# EAGLE design PSPi (EAGLE 7.6.0)
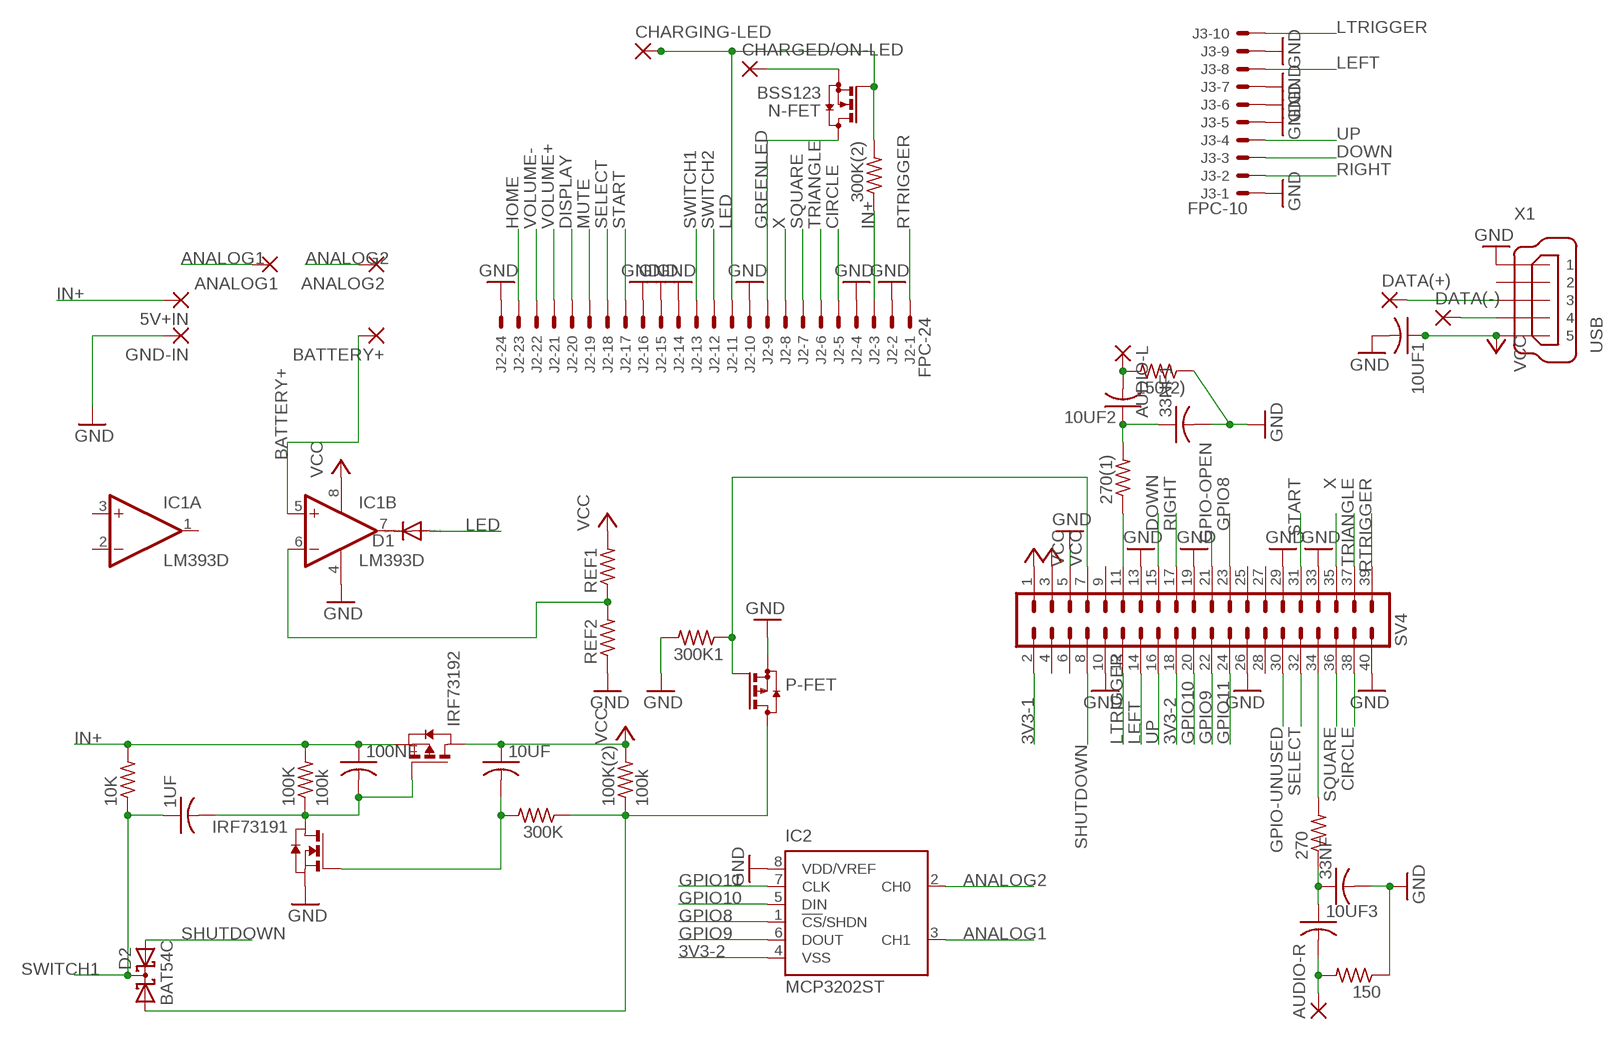
[diagram p0: schematic, sheet 1]

## Parts
1UF  C-USC0805  [C0805]
5V+IN  SMD2  [SMD1,27-2,54]
10K  R-US_R0805  [R0805]
10UF  C-USC0805  [C0805]
10UF1  C-USC0805  [C0805]
10UF2  C-USC0805  [C0805]
10UF3  C-USC0805  [C0805]
33NF  C-USC0805  [C0805]
33NF1  C-USC0805  [C0805]
100K  100k  R-US_R0805  [R0805]
100K(2)  100k  R-US_R0805  [R0805]
100NF  C-USC0805  [C0805]
150  R-US_R0805  [R0805]
150(2)  R-US_R0805  [R0805]
270  R-US_R0805  [R0805]
270(1)  R-US_R0805  [R0805]
300K  R-US_R0805  [R0805]
300K1  R-US_R0805  [R0805]
300K(2)  R-US_R0805  [R0805]
ANALOG1  SMD2  [SMD1,27-2,54]
ANALOG2  SMD2  [SMD1,27-2,54]
AUDIO-L  SMD2  [SMD1,27-2,54]
AUDIO-R  SMD2  [SMD1,27-2,54]
BATTERY+  SMD2  [SMD1,27-2,54]
CHARGED/ON-LED  SMD2  [SMD1,27-2,54]
CHARGING-LED  SMD2  [SMD1,27-2,54]
D1  DIODE-SOD323-R  [SOD323-R]
D2  BAT54C  [SOT23]
DATA(+)  SMD2  [SMD1,27-2,54]
DATA(-)  SMD2  [SMD1,27-2,54]
GND-IN  SMD2  [SMD1,27-2,54]
IC1  LM393D  [SO08]
IC2  MCP3202ST  [TSSOP8]
IRF7319  PN_MOSFET-SO8  [SO8]
J2  FPC-24  XF2R-2415-4A  [XF2R-2415-4A]
J3  FPC-10  XF2L-1035-1  [XF2L-1035-1]
N-FET  BSS123  [SOT23]
P-FET  BSS84  [SOT23]
REF1  R-US_R0805  [R0805]
REF2  R-US_R0805  [R0805]
SV4  MA20-2  [MA20-2]
X1  USB  MINI-USB-32005-201  [32005-201]

## Nets
3V3-1: SV4.2
3V3-2: IC2.4(VSS) SV4.18
ANALOG1: ANALOG1.1(P) IC2.3(CH1)
ANALOG2: ANALOG2.1(P) IC2.2(CH0)
BATTERY+: BATTERY+.1(P) IC1.5(B:+IN)
CIRCLE: J2.5 SV4.38
DISPLAY: J2.20
DOWN: J3.3 SV4.15
GND: 10UF1.2 33NF1.2 33NF.2 150(2).1 150.1 300K1.2 GND-IN.1(P) IC1.4(P:V-) IC2.8(VDD/VREF) IRF7319.1(1:S) J2.2 J2.4 J2.10 J2.14 J2.15 J2.16 J2.24 J3.1 J3.5 J3.6 J3.7 J3.9 P-FET.2(S) REF2.1 SV4.5 SV4.10 SV4.13 SV4.19 SV4.26 SV4.29 SV4.33 SV4.40 X1.1
GPIO8: IC2.1(!CS!/SHDN) SV4.23
GPIO9: IC2.6(DOUT) SV4.22
GPIO10: IC2.5(DIN) SV4.20
GPIO11: IC2.7(CLK) SV4.24
GPIO-OPEN: SV4.21
GPIO-UNUSED: SV4.30
GREENLED: J2.9 N-FET.3(D)
HOME: J2.23
IN+: 5V+IN.1(P) 10K.2 100K.2 100NF.1 300K(2).1 IRF7319.3(2:S) J2.3
LED: 300K(2).2 CHARGING-LED.1(P) D1.A J2.11 N-FET.1(G)
LEFT: J3.8 SV4.14
LTRIGGER: J3.10 SV4.12
MUTE: J2.19
N$1: IC1.6(B:-IN) REF1.1 REF2.2
N$2: D1.C IC1.7(B:OUT)
N$3: 1UF.2 100K.1 100NF.2 IRF7319.4(2:G) IRF7319.7(1:D) IRF7319.8(1:D)
N$4: DATA(-).1(P) X1.4
N$5: 10UF.2 300K.2 IRF7319.2(1:G)
N$6: 100K(2).1 300K.1 D2.1(A1) P-FET.3(D)
N$7: 300K1.1 P-FET.1(G) SV4.7
N$8: 10UF3.1 33NF.1 270.1
N$9: CHARGED/ON-LED.1(P) N-FET.2(S)
N$10: DATA(+).1(P) X1.3
N$11: 10UF2.1 33NF1.1 270(1).2
N$12: 10UF3.2 150.2 AUDIO-R.1(P)
N$13: 270.2 SV4.34
N$14: 270(1).1 SV4.11
N$16: 10UF2.2 150(2).2 AUDIO-L.1(P)
RIGHT: J3.2 SV4.17
RTRIGGER: J2.1 SV4.39
SELECT: J2.18 SV4.32
SHUTDOWN: D2.2(A2) SV4.8
SQUARE: J2.7 SV4.36
START: J2.17 SV4.31
SWITCH1: 1UF.1 10K.1 D2.3(CC) J2.13
SWITCH2: J2.12
TRIANGLE: J2.6 SV4.37
UP: J3.4 SV4.16
VCC: 10UF1.1 10UF.1 100K(2).2 IC1.8(P:V+) IRF7319.5(2:D) IRF7319.6(2:D) REF1.2 SV4.1 SV4.3 X1.5
VOLUME+: J2.21
VOLUME-: J2.22
X: J2.8 SV4.35
Unconnected: IC1.1(A:OUT) IC1.2(A:-IN) IC1.3(A:+IN) SV4.4 SV4.6 SV4.9 SV4.25 SV4.27 SV4.28 X1.2

## Library data of the parts
1UF 10UF 10UF1-10UF3 33NF 33NF1 100NF = resistor:C-US: CAPACITOR, American symbol
5V+IN ANALOG1 ANALOG2 AUDIO-L AUDIO-R BATTERY+ CHARGED/ON-LED CHARGING-LED DATA(+) DATA(-) GND-IN = wirepad:SMD2: SMD PAD
10K 100K 100K(2) 150 150(2) 270 270(1) 300K 300K1 300K(2) REF1 REF2 = resistor:R-US_: RESISTOR, American symbol
D1 = diode:DIODE-: DIODE
D2 = diode:BAT54C: Schottky Diodes Source: Fairchild .. BAT54.pdf
IC1 = linear:LM393: COMPARATOR
IC2 = microchip:MCP3202: 2.7V Dual Channel 12-Bit A/D Converter with SPI Serial Interface Source: http://ww1.microchip.com/downloads/en/DeviceDoc/21034D.pdf; MF: MICROCHIP; MPN: MCP3202-CI/ST; OC_FARNELL: unknown; OC_NEWARK: 59K0226
IRF7319 = zetex:PN_MOSFET-: DUAL N AND P-CHANNEL ENHANCEMENT MODE MOSFET Source: Data sheet <http://www.farnell.com/datasheets/1693880.pdf>; OC_FARNELL: unknown; OC_NEWARK: unknown
J2 = con-omron:XF2*-24?: OMRON FPC Connector Source : http://www.omron.com/ecb/products/pdf/fpc.pdf; MPN: XF2R-2415-4A; OC_FARNELL: unknown; OC_NEWARK: 37M0946
J3 = con-omron:XF2*-10?: OMRON FPC Connector Source : http://www.omron.com/ecb/products/pdf/fpc.pdf; MPN: XF2L-1035-1A; OC_FARNELL: 1430928; OC_NEWARK: 59M3516
N-FET = transistor-small-signal:BSS123: N-CHANNEL MOS FET
P-FET = transistor-small-signal:BSS84: P-CHANNEL MOS FET
SV4 = con-lstb:MA20-2: PIN HEADER; OC_FARNELL: unknown; OC_NEWARK: unknown
X1 = con-cypressindustries:MINI-USB-: MINI USB-B Conector Source: www.cypressindustries.com; OC_FARNELL: unknown; OC_NEWARK: unknown

## Board
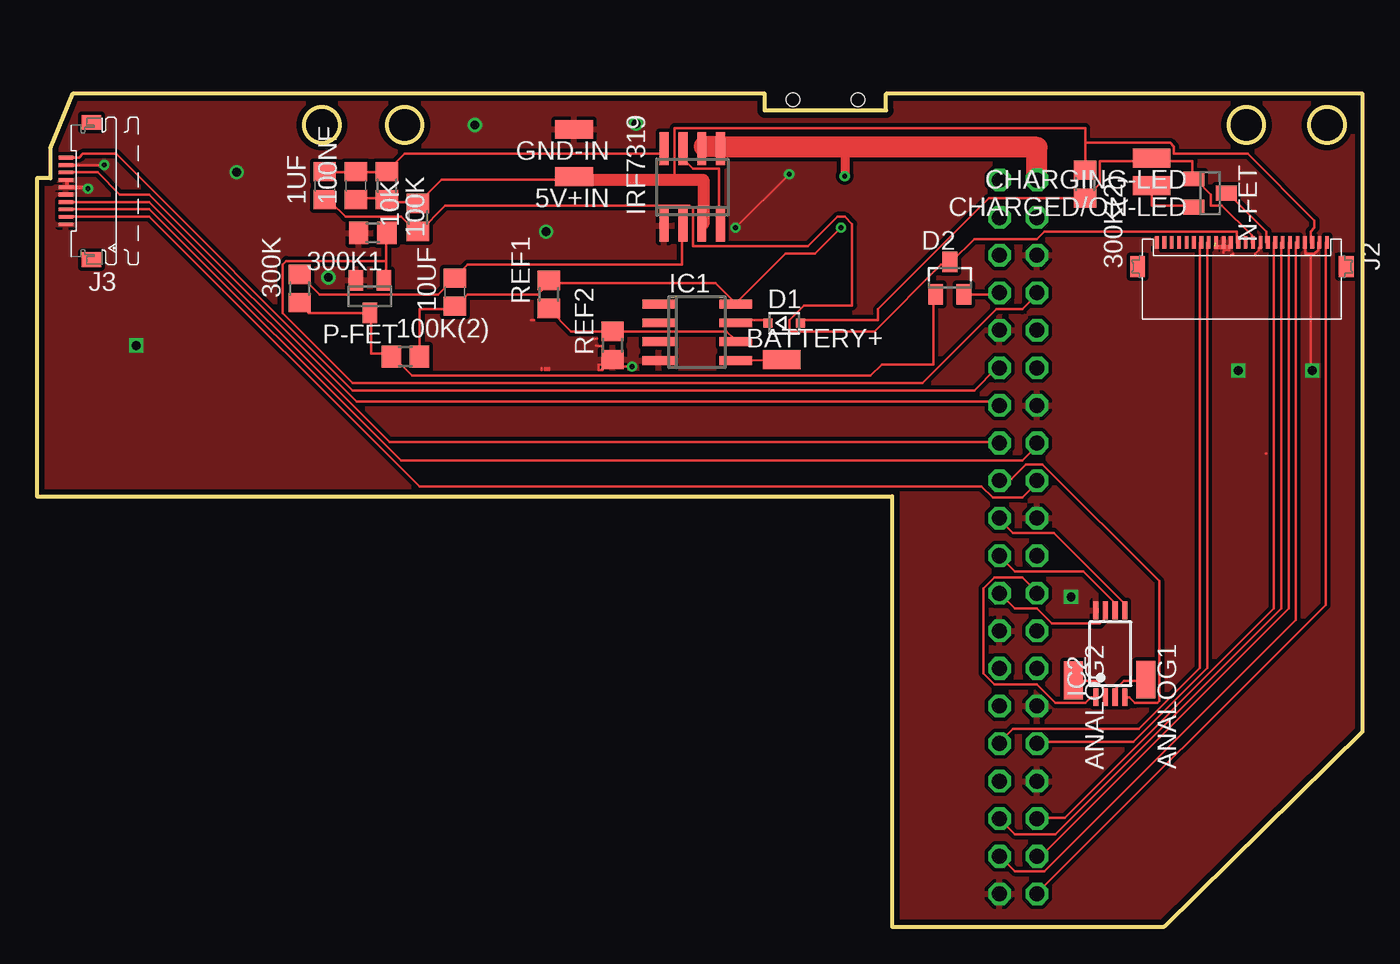
[diagram p1: board, top side]
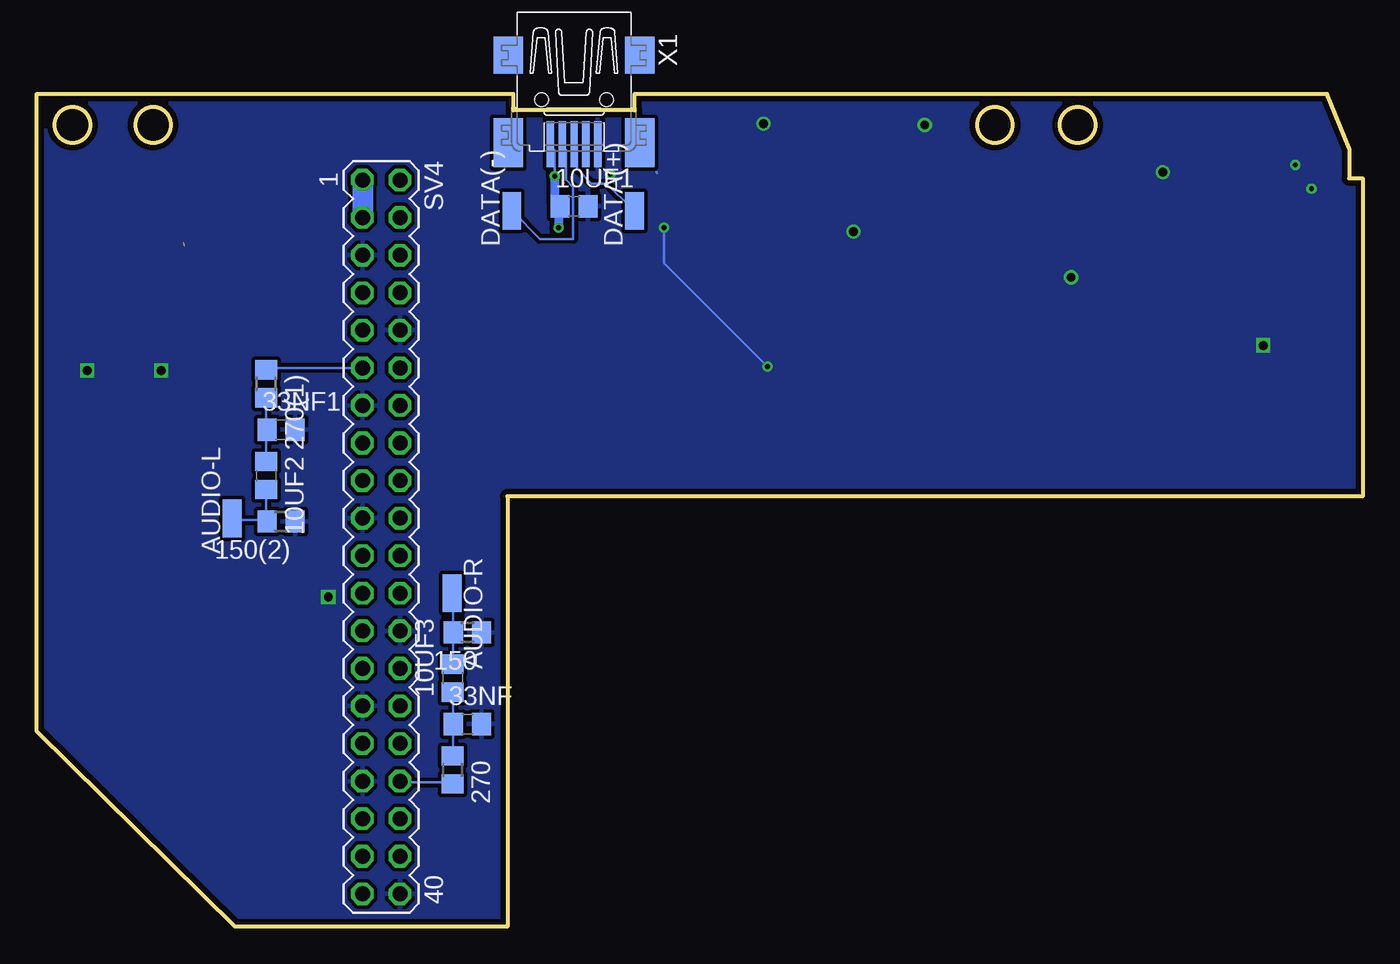
[diagram p2: board, bottom side, seen from below]

Size 89.6 x 56.3 mm. Coordinates in mm from the lower left corner, seen from the top.
Outline: 89.6,56.3 57.4,56.3 57.4,55.2 49.2,55.2 49.2,56.3 2.4,56.3 0.9,52.6 0.9,50.6 0,50.6 0,29.1 57.8,29.1 57.8,0 76.2,0 89.6,13.2 89.6,56.3
Outline: circle at 81.75,54.2 radius 1.2
Outline: circle at 87.2,54.2 radius 1.2
Outline: circle at 19.25,54.2 radius 1.2
Outline: circle at 24.85,54.2 radius 1.2
Copper layers (1*16): Top 0.0356mm / dielectric 1.5011mm / Bottom 0.0356mm
Design rules "OSHPark": minimum track width 6mil, minimum drill 13mil, track to track 6mil, track to pad 6mil, pad to pad 6mil, via to via 6mil, smd to smd 6mil, copper to edge 15mil, drill to drill 6mil, minimum pad ring 7mil, minimum via ring 7mil, stop-mask expansion 4mil, vias tented up to drill 0mil, thermal gap 10mil

### Footprints (pad centres in the part's own frame; a part is rotated, then mirrored left to right if it is on the bottom)
C0805 = smd 1.3 x 1.5: 1 -0.95,0; 2 0.95,0
SMD1,27-2,54 = smd 1.27 x 2.54: 1 0,0
R0805 = smd 1.3 x 1.5: 1 -0.95,0; 2 0.95,0
SOD323-R = smd 0.6 x 0.6: A 1.1,0; C -1.1,0
SOT23 = smd 1 x 1.4: 1 -0.95,-1.1; 2 0.95,-1.1; 3 0,1.1
SO08 = smd 0.6 x 2.2: 1 -1.905,-2.6; 2 -0.635,-2.6; 3 0.635,-2.6; 4 1.905,-2.6; 5 1.905,2.6; 6 0.635,2.6; 7 -0.635,2.6; 8 -1.905,2.6
TSSOP8 = smd 0.35 x 1.2: 1 -0.975,-2.925; 2 -0.325,-2.925; 3 0.325,-2.925; 4 0.975,-2.925; 5 0.975,2.925; 6 0.325,2.925; 7 -0.325,2.925; 8 -0.975,2.925
SO8 = smd 0.6 x 2.2: 1 -1.905,-2.6; 2 -0.635,-2.6; 3 0.635,-2.6; 4 1.905,-2.6; 5 1.905,2.6; 6 0.635,2.6; 7 -0.635,2.6; 8 -1.905,2.6
XF2R-2415-4A = smd 0.85 x 0.25: 1 -2.54,5.75; 2 -2.54,5.25; 3 -2.54,4.75; 4 -2.54,4.25; 5 -2.54,3.75; 6 -2.54,3.25; 7 -2.54,2.75; 8 -2.54,2.25; 9 -2.54,1.75; 10 -2.54,1.25; 11 -2.54,0.75; 12 -2.54,0.25; 13 -2.54,-0.25; 14 -2.54,-0.75; 15 -2.54,-1.25; 16 -2.54,-1.75; 17 -2.54,-2.25; 18 -2.54,-2.75; 19 -2.54,-3.25; 20 -2.54,-3.75; 21 -2.54,-4.25; 22 -2.54,-4.75; 23 -2.54,-5.25; 24 -2.54,-5.75 | smd 1.4 x 1: M1 -0.915,7.05; M2 -0.915,-7.05
XF2L-1035-1 = smd 1 x 0.25: 1 1.905,2.25; 2 1.905,1.75; 3 1.905,1.25; 4 1.905,0.75; 5 1.905,0.25; 6 1.905,-0.25; 7 1.905,-0.75; 8 1.905,-1.25; 9 1.905,-1.75; 10 1.905,-2.25 | smd 1.34 x 1: M1 0.18,4.638; M2 0.18,-4.638
MA20-2 = drill 1.016 octagon: 1 -24.13,-1.27; 2 -24.13,1.27; 3 -21.59,-1.27; 4 -21.59,1.27; 5 -19.05,-1.27; 6 -19.05,1.27; 7 -16.51,-1.27; 8 -16.51,1.27; 9 -13.97,-1.27; 10 -13.97,1.27; 11 -11.43,-1.27; 12 -11.43,1.27; 13 -8.89,-1.27; 14 -8.89,1.27; 15 -6.35,-1.27; 16 -6.35,1.27; 17 -3.81,-1.27; 18 -3.81,1.27; 19 -1.27,-1.27; 20 -1.27,1.27; 21 1.27,-1.27; 22 1.27,1.27; 23 3.81,-1.27; 24 3.81,1.27; 25 6.35,-1.27; 26 6.35,1.27; 27 8.89,-1.27; 28 8.89,1.27; 29 11.43,-1.27; 30 11.43,1.27; 31 13.97,-1.27; 32 13.97,1.27; 33 16.51,-1.27; 34 16.51,1.27; 35 19.05,-1.27; 36 19.05,1.27; 37 21.59,-1.27; 38 21.59,1.27; 39 24.13,-1.27; 40 24.13,1.27
32005-201 = smd 3.1 x 0.5: 1 3,1.6; 2 3,0.8; 3 3,0; 4 3,-0.8; 5 3,-1.6 | smd 2.5 x 2: M1 -3,-4.45; M2 -3,4.45 | smd 3.3 x 2: M3 2.9,4.45; M4 2.9,-4.45 | hole 0.9: 0,2.2; 0,-2.2

### Placement (x,y rotation side)
1UF  19.45,50.1 90 top
5V+IN  36.3,50.7 90 top
10K  25.75,47.95 90 top
10UF  28.25,42.9 90 top
10UF1  53.3,48.7 0 bottom
10UF2  74.1,30.5 270 bottom
10UF3  61.5,16.8 90 bottom
33NF  60.5,13.7 0 bottom
33NF1  73.1,33.6 0 bottom
100K  23.65,50.1 270 top
100K(2)  24.9,38.55 0 top
100NF  21.55,50.1 90 top
150  60.5,19.9 180 bottom
150(2)  73.1,27.4 180 bottom
270  61.5,10.6 270 bottom
270(1)  74.1,36.7 270 bottom
300K  17.75,43.15 90 top
300K1  22.7,46.9 180 top
300K(2)  70.85,50.2 270 top
ANALOG1  74.95,16.7 180 top
ANALOG2  70.05,16.65 180 top
AUDIO-L  76.4,27.6 0 bottom
AUDIO-R  61.55,22.55 180 bottom
BATTERY+  50.35,38.35 270 top
CHARGED/ON-LED  75.35,50.1 90 top
CHARGING-LED  75.35,51.95 90 top
D1  50.5,40.8 0 top
D2  61.7,43.85 0 top
DATA(+)  49.2,48.4 0 bottom
DATA(-)  57.5,48.4 0 bottom
GND-IN  36.3,53.9 90 top
IC1  44.62,40.19 270 top
IC2  72.55,18.45 0 top
IRF7319  44.3,50 0 top
J2  81.45,43.71 270 top
J3  3.86,49.74 180 top
N-FET  79.3,49.6 270 top
P-FET  22.5,42.6 180 top
REF1  34.6,42.75 90 top
REF2  38.9,39.3 90 top
SV4  66.33,26.35 270 bottom
X1  53.3,55.9 270 bottom

### Tracks (layer width: path | path; a pad name or v marks a point on that pad's centre or on a via)
3V3-2
  Top 0.152: IC2.4 73.6,15.5 73.85,15.5 74.22,15.12 75.72,15.12 75.85,15.25 75.85,23.38 67.97,31.25 66.85,31.25 65.85,30.25 65.1,30.25 SV4.18
ANALOG1
  Top 0.152: IC2.3 72.97,15.62 72.97,16.12 73.47,16.62 74.85,16.62 ANALOG1.1
ANALOG2
  Top 0.152: IC2.2 72.22,16 71.6,16.62 70.1,16.62 ANALOG2.1
BATTERY+
  Top 0.152: BATTERY+.1 47.35,38.25 IC1.5
CIRCLE
  Top 0.152: J2.5 85.1,46.25 85.1,20.75 68.1,3.75 66.1,3.75 65.1,4.75 SV4.38
DOWN
  Top 0.152: J3.3 2.1,48.5 7.6,48.5 24.6,31.5 66.6,31.5 67.6,32.5 SV4.15
GND  (via drill 0.33, 0.6)  (1 unrouted)
  Top 0.152: 37.85,39.75 37.69,39.72 | REF2.1 38.98,38.38 38.78,38.38 | 34.6,37.62 34.6,37.78 | 34.35,37.62 34.35,37.78 | 34.1,37.62 34.1,37.78 | 34.48,37.62 34.48,37.78 | v40.23,37.88 39.23,37.88 39.1,38 38.48,38 38.35,37.88 38.23,37.88 38.23,37.62 37.98,37.62 37.98,38 38.35,38 38.6,37.75 38.98,37.75 39.23,38 39.23,38.75 38.23,38.75 38.23,39.25 37.98,39.25 37.8,39.3 | v50.85,50.88 v47.23,47.25 | 83.1,32 83.07,32 | J2.14 80.72,46.25 80.72,46 79.6,46 79.6,45.88 80.6,45.88 80.6,45.75 80.22,45.75 80.2,45.56 | J2.10 82.72,46.25 82.72,45.88 82.6,45.88 82.6,45.75 82.35,45.5 82.35,45.37 | 86.1,45.5 86.35,45.5 86.6,45.75 86.6,46.25 J2.2 | 86.1,45.5 85.72,45.5 85.72,46.25 J2.4 | 86.1,45.5 86.1,37.62 v86.2,37.6 | 80.85,45.5 80.7,45.37 | v4.55,51.5 2.1,51.5 J3.9 | 33.6,41 33.39,41
  Top 0.254: J3.7 2,50.49 2,50 3.45,50 v3.45,49.9
  Bottom 0.152: 47.73,51 47.68,50.95 | v40.23,37.88 47.23,44.88 v47.23,47.25
  other vias: 81.2,37.6 19.7,43.9 34.4,47 29.6,54.2 40.5,54.3 6.7,39.3 13.5,51 69.9,22.3
  pour Top (isolate 0.254): -28.75,-11 105.8,-11.7 107,60.35 -29.45,61.05
  pour Bottom (isolate 0.254): -31.5,-8.2 104.5,-7.9 105.5,62.6 -31.4,62.4
GPIO8
  Top 0.152: IC2.1 71.47,15.5 71.22,15.5 70.85,15.12 68.85,15.12 67.6,16.38 64.72,16.38 63.98,17.12 63.98,22.88 64.72,23.62 66.6,23.62 67.6,22.62 SV4.23
GPIO9
  Top 0.152: IC2.6 72.85,21.38 72.85,21.88 70.72,24 66.1,24 65.1,25 SV4.22
GPIO10
  Top 0.152: IC2.5 73.47,21.38 73.47,21.88 68.72,26.62 65.97,26.62 65.1,27.5 SV4.20
GPIO11
  Top 0.152: IC2.7 72.22,20.88 71.85,20.5 68.6,20.5 67.6,21.5 66.1,21.5 SV4.24
GREENLED
  Top 0.152: J2.9 83.1,46.25 83.1,47 80.6,49.5 N-FET.3
IN+
  Top 0.152: 100NF.1 21.85,49.25 23.6,49.25 100K.2 23.85,49 25.6,49 10K.2 27.35,50.5 36.1,50.5 5V+IN.1 36.35,50.5 | 45.05,47.5 IRF7319.3 | 70.85,53 76.6,53 76.85,52.75 76.85,52.25 81.85,52.25 86.35,47.75 86.35,47.25 86.1,47 86.1,46.25 J2.3 | 300K(2).1 70.85,53 | 42.85,50.5 43.1,50.75 43.1,54 70.85,54 70.85,53
  Top 0.813: 45.05,47.5 45.05,50.5 42.85,50.5 36.35,50.5
LED
  Top 0.152: J2.11 82.1,46.25 82.1,46.75 80.1,48.75 79.35,48.75 79.35,49.5 78.35,50.5 N-FET.1 78.1,50.75 78.1,51.75 75.35,51.75 | D1.A 51.6,41 56.85,41 56.85,41.75 64.35,49.25 300K(2).2 71.85,50.25 71.85,51.75 75.35,51.75 | 75.35,51.75 CHARGING-LED.1
LEFT
  Top 0.152: J3.8 2.1,51 4.1,51 5.6,49.5 7.6,49.5 21.6,35.5 64.6,35.5 SV4.14
LTRIGGER
  Top 0.152: J3.10 2.1,52 2.85,52 3.1,52.25 5.35,52.25 21.35,36.25 63.35,36.25 64.85,37.75 SV4.12
N$1
  Top 0.152: REF1.1 34.6,41.75 36.1,40.25 REF2.2 46.6,40.25 47.1,39.75 IC1.6
N$2
  Top 0.152: D1.C 49.35,41 47.35,41 IC1.7
N$3
  Top 0.152: 1UF.2 19.85,51 21.6,51 100NF.2 21.85,51 23.6,51 100K.1 24.85,52.25 42.1,52.25 42.35,52.5 IRF7319.8 | IRF7319.4 46.1,47.5 46.1,51.25 44.35,51.25 43.85,51.75 43.85,52.5 IRF7319.7
N$4
  Bottom 0.152: DATA(-).1 55.6,46.5 53.35,46.5 53.35,50 53.85,50.5 53.85,52.5 54.1,52.75 X1.4
N$5
  Top 0.152: 300K.2 19.1,42.75 27.1,42.75 28.1,43.75 10UF.2 28.35,44 29.1,44.75 43.6,44.75 43.6,47.25 IRF7319.2
N$6
  Top 0.152: D2.1 60.6,42.75 60.6,38 57.1,38 56.35,37.25 25.35,37.25 24.1,38.5 100K(2).1 23.85,38.75 22.6,38.75 22.6,41.5 P-FET.3 18.35,41.5 17.85,42 300K.1
N$7
  Top 0.152: 23.6,45 23.6,47 300K1.1 | 23.6,45 23.6,43.75 P-FET.1 | 23.6,45 16.85,45 16.6,44.75 16.6,41.5 21.35,36.75 59.85,36.75 64.85,41.75 66.6,41.75 67.6,42.75 SV4.7
N$8
  Bottom 0.152: 10UF3.1 61.48,15.75 61.48,13.75 33NF.1 61.48,13.62 61.48,11.62 270.1
N$9
  Top 0.152: CHARGED/ON-LED.1 75.35,48.75 78.1,48.75 N-FET.2
N$10
  Bottom 0.152: DATA(+).1 49.35,48.5 51.1,50.25 52.1,50.25 53.1,51.25 53.1,52.75 X1.3
N$11
  Bottom 0.152: 10UF2.1 74.1,33.5 33NF1.1 74.1,34 270(1).2
N$12
  Bottom 0.152: 10UF3.2 61.48,17.75 61.48,19.88 150.2 61.48,20 61.48,22.5 AUDIO-R.1
N$13
  Bottom 0.152: 270.2 61.6,9.75 64.97,9.75 SV4.34
N$14
  Bottom 0.152: 270(1).1 74.1,37.75 67.6,37.75 SV4.11
N$16
  Bottom 0.152: 76.47,27.62 AUDIO-L.1 76.1,27.5 74.1,27.5 | 10UF2.2 74.1,27.5 | 74.1,27.5 150(2).2
RIGHT
  Top 0.152: J3.2 2.1,48 7.6,48 25.85,29.75 63.85,29.75 64.6,29 66.6,29 67.6,30 SV4.17
RTRIGGER
  Top 0.152: J2.1 87.1,46.25 87.1,21.75 67.6,2.25 SV4.39
SELECT
  Top 0.152: J2.18 78.6,46.25 78.6,17.5 74.47,13.38 65.97,13.38 65.1,12.5 SV4.32
SHUTDOWN
  Top 0.152: D2.2 64.85,42.75 SV4.8
SQUARE
  Top 0.152: J2.7 84.1,46.25 84.1,21.5 68.85,6.25 66.1,6.25 65.1,7.25 SV4.36
START
  Top 0.152: J2.17 79.1,46.25 79.1,17.5 74.1,12.5 67.6,12.5 SV4.31
SWITCH1
  Top 0.152: 1UF.1 19.85,49 20.85,48 24.6,48 25.6,47 10K.1 25.85,47 27.6,48.75 44.1,48.75 44.35,48.5 44.35,46 52.1,46 54.1,48 54.6,48 55.1,47.5 55.1,42 51.85,42 50.85,41 50.85,40.25 56.6,40.25 61.1,44.75 61.6,44.75 D2.3 61.85,45 63.35,46.5 67.6,46.5 68.1,47 81.1,47 81.1,46.25 J2.13
TRIANGLE
  Top 0.152: J2.6 84.6,46.25 84.6,21.5 67.97,4.88 67.6,4.88 SV4.37
UP
  Top 0.152: J3.4 2.1,49 7.6,49 23.85,32.75 64.85,32.75 SV4.16
VCC  (via drill 0.33)
  Top 0.152: 100K(2).2 25.85,41.75 28.1,41.75 10UF.1 28.35,42 29.1,42.75 33.85,42.75 34.6,43.5 | 34.6,43.5 45.85,43.5 47.1,42.25 IC1.8 47.35,42.25 50.6,45.5 52.6,45.5 v54.35,47.25 | 34.6,43.5 REF1.2 | 45.1,52.75 IRF7319.6 | 46.1,52.75 IRF7319.5 46.35,52.7 | 67.6,50.5 SV4.1
  Top 0.61: 54.6,52.7 v54.6,50.75
  Top 1.422: 46.1,52.75 45.1,52.75 | 46.35,52.7 54.6,52.7 67.6,52.7 67.6,50.5
  Bottom 0.152: 54.6,49 54.35,48.75 10UF1.1 54.35,48.5 | v54.6,50.75 54.6,52.5 54.85,52.75 X1.5
  Bottom 0.61: v54.6,50.75 54.6,49 | 54.35,48.5 v54.35,47.25
  Bottom 1.422: SV4.1 SV4.3
X
  Top 0.152: J2.8 83.6,46.25 83.6,21.5 69.47,7.38 67.6,7.38 SV4.35